# Altium project DataLogger.PrjPcb
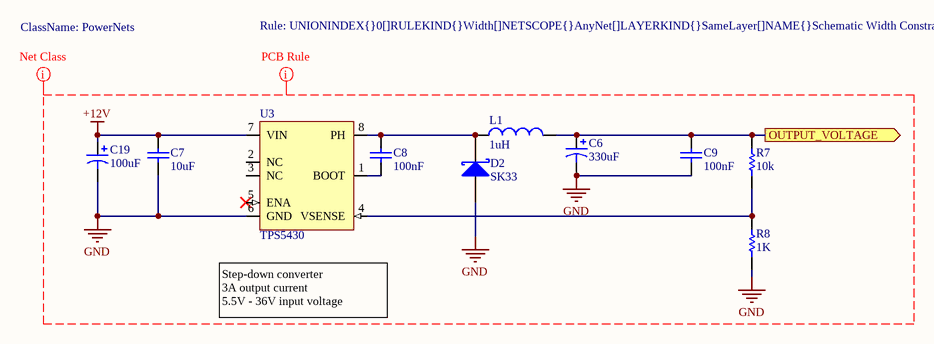
[diagram p0: PS.SchDoc]
2 sheets, 17 parts. Net scope: flat (ports and power ports of the same name join across sheets).
Board files: PCB1.PcbDoc, PCB2_homemade.PcbDoc, PCB3_factory.PcbDoc
Sheets:
  PS.SchDoc
  UART_TO_RS232.SchDoc

## Sheet PS.SchDoc
size A4; Author: Wojciech Grędel; Revision: 1

### Parts
C6  value 330uF  [CAP_SMD_D_IPC_MD]  (hidden comment: Cap Pol)
C7  value 10uF  [CAP_0805_IPC_MD]  (hidden comment: Cap)
C8  value 100nF  [CAP_0805_IPC_MD]  (hidden comment: Cap)
C9  value 100nF  [CAP_0805_IPC_MD]  (hidden comment: Cap)
C19  value 100uF  [CAPAE7866X80M]  (hidden comment: Cap Pol)
D2  SK33  [DO214AB_IPC_MD]
L1  value 1uH  [IND_DL50_IPC_MD]  (hidden comment: Inductor)
R7  value 10k  [RES_0805_IPC_MD]  (hidden comment: Res)
R8  value 1K  [RES_0805_IPC_MD]  (hidden comment: Res)
U3  TPS5430  [SOIC_8_THERMAL_PAD_IPC_MD]

### Ports
OUTPUT_VOLTAGE (out)

### Nets
+12V: C7.2 C19.1 U3.7(VIN)
GND: C6.2 C7.1 C9.1 C19.2 D2.1(A) R8.1 U3.6(GND) U3.9(PwPd)
NetC6_1: C6.1 C9.2 L1.2 R7.2 ; port OUTPUT_VOLTAGE
NetC8_1: C8.1 U3.1(BOOT)
NetC8_2: C8.2 D2.2(K) L1.1 U3.8(PH)
NetR7_1: R7.1 R8.2 U3.4(VSENSE)

Not connected (* = marked no-connect by the designer): U3 2(NC) 3(NC) 5(ENA)*

### Layout directives
net class PowerNets: +12V, GND
rule Width Constraint [Pref Width = 25mil    Min Width = 20mil    Max Width = 30mil]: +12V, GND

### Notes on the sheet
- (near U3) Step-down converter
  3A output current
  5.5V - 36V input voltage
- Confidential / Not for distribution !
- Project name:
- Document name:
- Designer Name:
- Date/Time:
- Revision:

### Library data of the parts
C6 C19 = Cap Pol: Polarized Capacitor (Axial); Manufacturer: AVX; Published: 8-Jun-2000; LatestRevisionDate: 17-Jul-2002; LatestRevisionNote: Re-released for DXP Platform.; PackageReference: POLAR0.8; Publisher: Altium Limited; PackageDescription: Polarized Capacitor; 2 Leads; Supplier: TME; Supplier Part Number: TPSD337K006R0045
C7 = Cap: Capacitor; Manufacturer: Sansung; Supplier Part Number: CL21A106KOQNNNF; Supplier: TME
C8 C9 = Cap: Capacitor; Manufacturer: Samsung; Supplier Part Number: CL21B104KBCNNNC; Supplier: TME
D2 = SK33: Schottky Diode; Manufacturer: Diotec; ManufacturerURL: http://diotec.com/tl_files/diotec/files/pdf/datasheets/sk32; Supplier: TME; Supplier Part Number: SK33-DIO
L1 = Inductor: Manufacturer: Ferrocore; Supplier: *; Supplier Part Number: *; Isat: *; Irms: *
R7 R8 = Res: Resistor; Supplier: *; Supplier Part Number: *; Manufacturer: *
U3 = TPS5430: 3-A, Wide Input Range, Step-Down Converter; Manufacturer: Texas Instruments; Supplier: TME; Supplier Part Number: TPS5430DDAR

## Sheet UART_TO_RS232.SchDoc
size A4; Author: Wojciech Grędel; Revision: 1
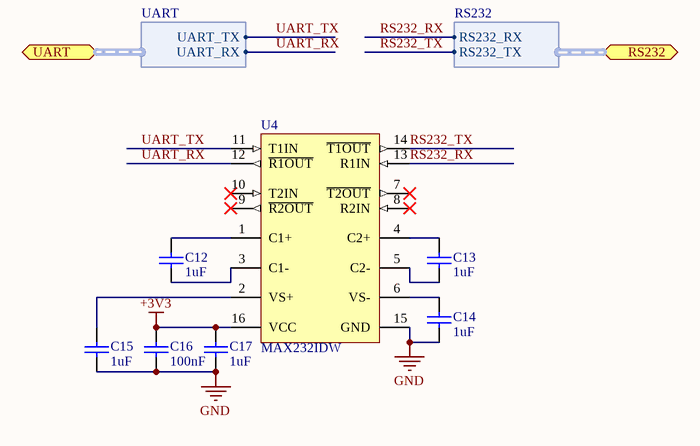
[diagram p1: UART_TO_RS232.SchDoc]

### Parts
C12  value 1uF  [CAP_0805_IPC_MD]  (hidden comment: Cap)
C13  value 1uF  [CAP_0805_IPC_MD]  (hidden comment: Cap)
C14  value 1uF  [CAP_0805_IPC_MD]  (hidden comment: Cap)
C15  value 1uF  [CAP_0805_IPC_MD]  (hidden comment: Cap)
C16  value 100nF  [CAP_0805_IPC_MD]  (hidden comment: Cap)
C17  value 1uF  [CAP_0805_IPC_MD]  (hidden comment: Cap)
U4  MAX232IDW  [SO_16_IPC_MD]

### Ports
RS232 (harness RS232), UART (harness UART)

### Harnesses
UART: UART_TX, UART_RX
RS232: RS232_RX, RS232_TX

### Nets
+3V3: C16.2 C17.2 U4.16(VCC)
GND: C14.1 C15.1 C16.1 C17.1 U4.15(GND)
RS232_RX: U4.13(R1IN) ; port RS232.RS232_RX
RS232_TX: U4.14(~{T1OUT}) ; port RS232.RS232_TX
UART_RX: U4.12(~{R1OUT}) ; port UART.UART_RX
UART_TX: U4.11(T1IN) ; port UART.UART_TX
NetC12_1: C12.1 U4.3(C1-)
NetC12_2: C12.2 U4.1(C1+)
NetC13_1: C13.1 U4.5(C2-)
NetC13_2: C13.2 U4.4(C2+)
NetC14_2: C14.2 U4.6(VS-)
NetC15_2: C15.2 U4.2(VS+)

Not connected (* = marked no-connect by the designer): U4 7(~{T2OUT})* 8(R2IN)* 9(~{R2OUT})* 10(T2IN)*

### Notes on the sheet
- Confidential / Not for distribution !
- Project name:
- Document name:
- Designer Name:
- Date/Time:
- Revision:

### Library data of the parts
C12-C17 = Cap: Capacitor; Manufacturer: Samsung; Supplier: TME
  C12-C15 C17: Supplier Part Number: CL21B105KOFNNNF
  C16: Supplier Part Number: CL21B104KBCNNNC
U4 = MAX232IDW: Dual EIA-232 Driver / Receiver, -40 to 85 degC, 16-Pin SOIC (DW), Green (RoHS & no Sb/Br); Manufacturer: Texas Instruments; SubFamily: RS-232; Drivers Per Package: 2; Supply Voltage(s)(V): 5; ESD HBM(kV): +/-2; ICC(Max)(mA): 10; Single Supply: TRUE; DatasheetVersion: SLLS047L; PackageVersion: revG, Jan-2011; PackageReference: DW16; PackageDescription: 16-Pin Small Outline Integrated Circuit, 10.3 x 7.5 mm, Pitch 1.27 mm Pitch; Receivers Per Package: 2; RS-232: TRUE; ComponentLink1Description: Manufacturer URL; ComponentLink1URL: www.ti.com; ComponentLink2Description: Datasheet; ComponentLink2URL: http://www.ti.com/general/docs/lit/getliterature.tsp?genericPartNumber=MAX232&fileType=pdf; ComponentLink3Description: Package Specification; ComponentLink3URL: http://www.ti.com/litv/pdf/msoi003g; Supplier: TME; Supplier Part Number: MAX232IDW

## Nets that join several sheets
GND: PS (8 pins), UART_TO_RS232 (5 pins)